# EAGLE schematic dashbutton_round_v2 (EAGLE 9.1.3)
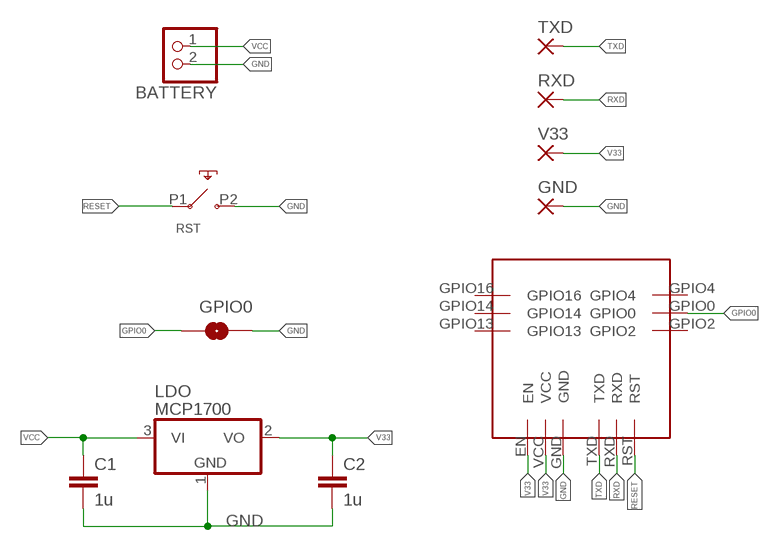
[diagram p0: schematic, sheet 1]

## Parts
BATTERY  JST_2PIN-SMT-RA  [JST-PH-2-SMT-RA]
C1  1u  C-EUC1206  [C1206]
C2  1u  C-EUC1206  [C1206]
GND  WIREPADSMD1,27-254  [SMD1,27-2,54]
GPIO0  JUMPER-SMT_2_NO_NO-SILK  [SMT-JUMPER_2_NO_NO-SILK]
LDO  MCP1700  MCP1703CB  [SOT23]
RST  6X3_SMD_BUTTON_HALF  [6X3BUTTON]
RXD  WIREPADSMD1,27-254  [SMD1,27-2,54]
TXD  WIREPADSMD1,27-254  [SMD1,27-2,54]
U$1  ESP8285-M3  [ESP8285]
V33  WIREPADSMD1,27-254  [SMD1,27-2,54]

## Nets
GND: BATTERY.2 C1.2 C2.2 GND.1(P) GPIO0.2 LDO.1(GND) RST.P2 U$1.GND
GPIO0: GPIO0.1 U$1.GPIO0
RESET: RST.P1 U$1.RST
RXD: RXD.1(P) U$1.RXD
TXD: TXD.1(P) U$1.TXD
V33: C2.1 LDO.2(VO) U$1.EN U$1.VCC V33.1(P)
VCC: BATTERY.1 C1.1 LDO.3(VI)
Unconnected: U$1.GPIO2 U$1.GPIO4 U$1.GPIO13 U$1.GPIO14 U$1.GPIO16

## Library data of the parts
BATTERY = adafruit:JST_2PIN: JST 2-Pin Connectors of various flavors SMT-RA (S2B-PH-SM4) 4UConnector #17311 SMT (B2B-PH-SM4) THM-RA (S2B-PH) THM (B2B-PH)
C1 C2 = rcl:C-EU: CAPACITOR, European symbol; SPICEPREFIX: C
GND RXD TXD V33 = wirepad:WIREPAD: Wire PAD connect wire on PCB
GPIO0 = SparkFun-Jumpers:JUMPER-SMT_2_NO: Normally open jumper This jumper has two pads in close proximity to each other. Apply solder to close the connection. Round pads are easier to solder for beginners, but are a lot larger. SparkFun Product that uses the round pads: SparkFun EL Sequencer <https://www.sparkfun.com/products/12781>
LDO = linear:MCP1703: 250 mA, 16V, Low Quiescent Current LDO Regulator Source: http://ww1.microchip.com/downloads/en/DeviceDoc/22049b.pdf
RST = moekoe:6X3_SMD_BUTTON_HALF
U$1 = moekoe:ESP8285-M3